# Altium schematic sheet Power.SchDoc
size A
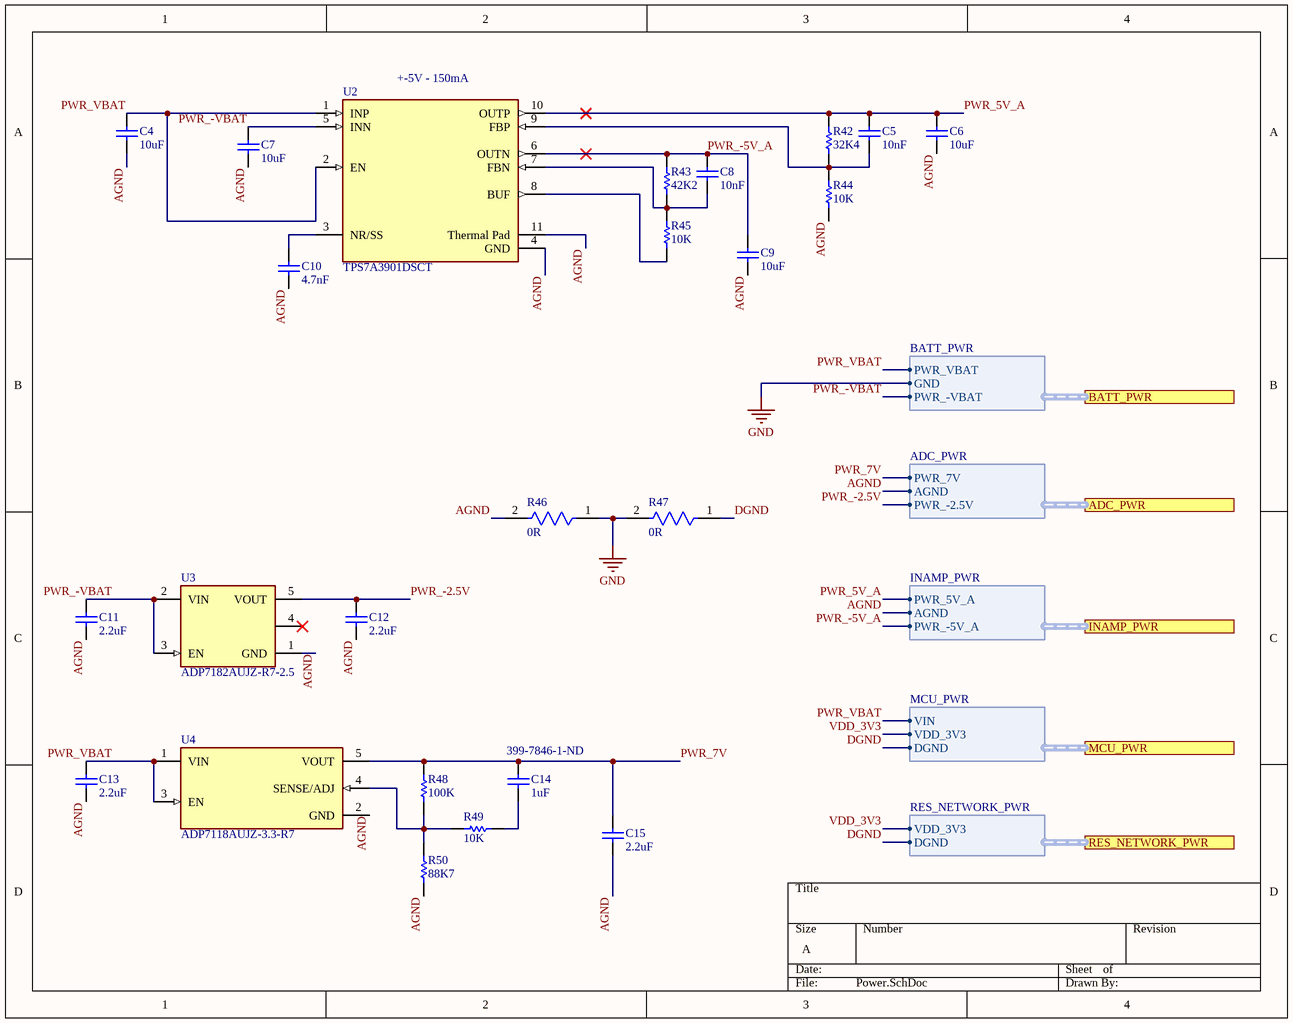
[diagram p0: Power.SchDoc]

## Parts
C4  10uF  [CAPC2013X135X45ML10T25]
C5  10nF  [CAPC1608X90X35LL15T15]
C6  10uF  [CAPC2013X135X45ML10T25]
C7  10uF  [CAPC2013X135X45ML10T25]
C8  10nF  [CAPC1608X90X35LL15T15]
C9  10uF  [CAPC2013X135X45ML10T25]
C10  4.7nF  [CAPC1608X90X35LL15T15]
C11  2.2uF  [CAPC1608X90X35ML10T15]
C12  2.2uF  [CAPC1608X90X35ML10T15]
C13  2.2uF  [CAPC1608X90X35ML10T15]
C14  1uF  Supplier Part Number 1: 399-7846-1-ND  [CAPC1608X95X35LL15T15]
C15  2.2uF  [CAPC1608X90X35ML10T15]
R42  32K4  [RESC1608X55X25ML10T15]
R43  42K2  [RESC0805(2012)_N]
R44  10K  [RESC1609X50X30NL8T20]
R45  10K  [RESC1609X50X30NL8T20]
R46  0R  [FP-CR0603-MFG]
R47  0R  [FP-CR0603-MFG]
R48  100K  [RESC1608X55X25ML10T15]
R49  10K  [RESC1609X50X30NL8T20]
R50  88K7  [RESC1608X55X25ML10T15]
U2  TPS7A3901DSCT  [TPS7A3901DSCT]
U3  ADP7182AUJZ-R7-2.5  [FP-UJ-5-IPC_A]
U4  ADP7118AUJZ-3.3-R7  [FP-UJ-5-IPC_C]

## Ports
ADC_PWR (harness ADC_PWR), BATT_PWR (harness BATT_PWR), INAMP_PWR (harness INAMP_PWR), MCU_PWR (harness MCU_PWR), RES_NETWORK_PWR (harness RES_NETWORK_PWR)

## Harnesses
RES_NETWORK_PWR: VDD_3V3, DGND
MCU_PWR: VDD_3V3, DGND, VIN
INAMP_PWR: AGND, PWR_-5V_A, PWR_5V_A
ADC_PWR: AGND, PWR_-2.5V, PWR_7V
BATT_PWR: GND, PWR_-VBAT, PWR_VBAT

## Nets
GND: R46.1 R47.2 ; port BATT_PWR.GND
AGND: C4.1 C6.1 C7.1 C9.1 C10.1 C11.1 C12.1 C13.1 C15.1 R44.1 R46.2 R50.1 U2.4(GND) U2.11(Thermal_Pad) U3.1(GND) U4.2(GND) ; port INAMP_PWR.AGND, port ADC_PWR.AGND
DGND: R47.1 ; port RES_NETWORK_PWR.DGND, port MCU_PWR.DGND
PWR_5V_A: C5.2 C6.2 R42.1 U2.10(OUTP) ; port INAMP_PWR.PWR_5V_A
PWR_7V: C14.2 C15.2 R48.2 U4.5(VOUT) ; port ADC_PWR.PWR_7V
PWR_-2.5V: C12.2 U3.5(VOUT) ; port ADC_PWR.PWR_-2.5V
PWR_-5V_A: C8.2 C9.2 R43.2 U2.6(OUTN) ; port INAMP_PWR.PWR_-5V_A
PWR_-VBAT: C7.2 C11.2 U2.5(INN) U3.2(VIN) U3.3(EN) ; port BATT_PWR.PWR_-VBAT
PWR_VBAT: C4.2 C13.2 U2.1(INP) U2.2(EN) U4.1(VIN) U4.3(EN) ; port MCU_PWR.VIN, port BATT_PWR.PWR_VBAT
VDD_3V3: port RES_NETWORK_PWR.VDD_3V3, port MCU_PWR.VDD_3V3
NetC5_1: C5.1 R42.2 R44.2 U2.9(FBP)
NetC8_1: C8.1 R43.1 R45.2 U2.7(FBN)
NetC10_2: C10.2 U2.3(NR/SS)
NetC14_1: C14.1 R49.2
NetR45_1: R45.1 U2.8(BUF)
NetR48_1: R48.1 R49.1 R50.2 U4.4(SENSE/ADJ)

Not connected (* = marked no-connect by the designer): U3 4(ADJ)*

## Notes on the sheet
- (near U2) +-5V - 150mA

## Library data of the parts
C4 C6 C7 C9 = CMP-2007-03541-1: Part Number: GRM21BR61E106KA73L; Manufacturer: Murata
C5 C8 = CMP-2006-04374-1: Manufacturer: AVX Interconnect / Elco; Part Number: 06035C-103KAT2A
C10 = CMP-2006-04439-1: Part Number: 06035C472KAT2A; Manufacturer: AVX Interconnect / Elco
C11-C13 C15 = CMP-2006-02820-1: Part Number: GRM188R61E225KA12D; Manufacturer: Murata
C14 = CMP-2006-02216-1: Manufacturer: Kemet; Part Number: C0603C105K3PACTU; Description: KEMET - C0603C105K3PACTU - SMD Multilayer Ceramic Capacitor, 1 µF, 25 V, 0603 [1608 Metric], ± 10%, X5R, C Series KEMET; Dielectric Material: Ceramic; Tolerance: 10%; Dielectric: X5R; Voltage Rating (DC): 25V; Supplier 1: Digi-Key; Manufacturer Part Number: C0603C105K3PACTU; RoHS: Yes; Category: Ceramic Capacitors; Stock 1: 157618; Pricing 1: 1=0.18000, 10=0.12700, 50=0.07220, 100=0.05980, 500=0.04194, 1000=0.03472 (USD); Mount: Surface Mount; Case/Package: 0603; Contact Plating: Tin,Matte; Min Operating Temperature: -55°C; Max Operating Temperature: 85°C; Capacitance: 1uF; Packaging: Tape and Reel; Voltage: 25V; Termination: SMD/SMT; Length: 1.6mm; Height: 0.8mm; Depth: 0.8mm; Radiation Hardening: No; Lead Free: Lead Free; ComponentLink1URL: https://datasheet.ciiva.com/28610/1918694-28610792.pdf?src-supplier=Element14; ComponentLink1Description: https://datasheet.ciiva.com/28610/1918694-28610792.pdf?src-supplier=Element14; ComponentLink2URL: https://datasheet.ciiva.com/5998/40889-5998745.pdf?src-supplier=Farnell; ComponentLink2Description: https://datasheet.ciiva.com/5998/40889-5998745.pdf?src-supplier=Farnell; Supplier Unit Price 1: 0.18
R42 = CMP-2000-04011-1: Manufacturer: Yageo; Part Number: RC0603FR-0732K4L
R43 = CMP-1013-00693-1: 42K2 0.125W 1% 0805 (2012 Metric)  SMD; Case-EIA: 0805; Value: 42200.00 Ohm; Case-Metric: 2012; Power: 0.125 W; Tolerance: 1 %; Technology: SMT
R44 R45 R49 = CMP-1666-00005-4: Chip Resistor, 10 KOhm, +/- 1%, 100 mW, -55 to 155 degC, 0603 (1608 Metric), RoHS, Tape and Reel; Manufacturer: Vishay Semiconductor; Voltage Rating: 75 V; Max Operating Temperature: 155 degC; PackageDescription: 2-Pin Surface Mount Device, Body 1.575 x 0.85 mm; ComponentLink1Description: Manufacturer URL; RoHSCompliant: true; PackageReference: 0603; REACH SVHC: Unknown; Length: 1.55 mm; DatasheetVersion: 06/2012; Packaging: Tape and Reel; Min Operating Temperature: -55 degC; Mounting Technology: Surface Mount; ComponentLink2URL: https://datasheet.ciiva.com/11809/0900766b80d98afc-11809037.pdf; Height: 0.45 mm; ComponentLink2Description: Datasheet; Package Quantity: 5000; ComponentLink1URL: http://www.vishay.com/
R46 R47 = CMP-07231-000023-1: Thick Film Chip Resistors 0603 0Ω 0.1W 5%; Power Rating: 100mW; Resistance: 0mR; Voltage Rating (DC): 50V; Tolerance: 1%; Temperature Coefficient: 500ppm/°C; Depth: 0.8mm; Height: 0.45mm; Case Code (Metric): 1608; Number of Pins: 2; Max Operating Temperature: 155°C; Mount: Surface Mount; REACH SVHC: No SVHC; Radiation Hardening: No; Width: 0.8mm; Max Power Dissipation: 100mW; Thickness: 457um; Package Quantity: 5000; Composition: Thick Film; Case/Package: 0603; Military Standard: Not; Packaging: Tape and Reel; Voltage Rating: 50V; Case Code (Imperial): 0603; Min Operating Temperature: -55°C; Contact Plating: Tin; Length: 1.6mm; Termination: SMD/SMT
R48 = CMP-2100-03662-1: Chip Resistor, 100 KOhm, +/- 1%, 0.1 W, -55 to 155 degC, 0603 (1608 Metric), RoHS, Tape and Reel; Manufacturer: Yageo; Power Rating: 100mW; Voltage Rating: 50V; Temperature Coefficient: 100ppm/degreesC; Datasheet Version: Rev. 5, 10/2016; Height: 0.45mm; Lead Free: LeadFree; Manufacturer URL: http://www.yageo.com/; Package Reference: 0603; Depth: 0.8mm; RoHSCompliant: true; Composition: ThickFilm; Military Standard: Not; Resistance: 100KOhm; Case/Package: 0603; Packaging: TapeandReel; Case Code (Imperial): 0603; Voltage Rating (DC): 50V; Case Code (Metric): 1608; Tolerance: 1%; Termination: SMD/SMT; Min Operating Temperature: -55degC; Number of Pins: 2; Length: 1.6mm; Width: 0.8mm; Datasheet URL: http://www.yageo.com/NewPortal/yageodocoutput?fileName=/pdf/R-Chip/PYu-RC_Group_51_RoHS_L_5.pdf; Package Description: 2-Pin Surface Mount Device, Body 1.6 x 0.8 mm; Max Operating Temperature: 155degC; REACH SVHC: NoSVHC
R50 = CMP-2000-04152-1: Manufacturer: Yageo; Part Number: RC0603FR-0788K7L
U2 = TPS7A3901DSCT: Manufacturer 1: Texas Instruments; Supplier 1: Digi-Key; Supplier Part Number 1: 296-47504-1-ND; Manufacturer Part Number 1: TPS7A3901DSCT
U3 = CMP-09138-000013-1: IC REG LIN NEG ADJ 200MA 5TSOT; Manufacturer: Analog Devices; Number Of Outputs: 1; Min Supply Voltage: -2.7V; Max Junction Temp: +125°C; Dropout Voltage: -185mV; Output Current: -200mA; Max Supply Voltage: -28V; Output Voltage: -1.22/-27.815V; Nominal Supply Current: -33/-650uA; Output Type: AdjustableProgrammable; Accuracy Percentage: 1%; RoHS: TRUE; Ambient Temperature Range Low: -40°C; Digikey Description: IC REG LIN NEG ADJ 200MA 5TSOT; Device Class L3: Voltage Regulators - Linear; Ambient Temperature Range High: +85°C; Manufacturer Part Number: ADP7182AUJZ-R7; ComponentLink2URL: https://www.analog.com/media/en/technical-documentation/data-sheets/ADP7182.pdf; Ipc Land Pattern Name: SOT95P280X100-5; Temperature Range Low: -40°C; ComponentLink2Description: Datasheet; Mouser Description: LDO Regulator Neg -1.22V to -27V 0.2A 5-Pin TSOT T/R; Category: IC; Automotive: No; Device Class L1: Integrated Circuits (ICs); Temperature: -40°C to +125°C; Octopart: https://octopart.com/adp7182aujz-r7-analog+devices-21054665; Device Class L2: Power Management ICs; Height: 1mm; Package: UJ-5; Temperature Range High: +125°C; Lead Free: Yes
U4 = CMP-09138-000020-1: IC REG LIN 3.3V 200MA TSOT23-5; Dropout Voltage: 200mV; Number of Regulators: 1; Max Input Voltage: 20V; Output Type: Fixed; Min Input Voltage: 2.7V; Quiescent Current: 140uA; Polarity: Positive; Min Current Limit: 250mA; Accuracy: 0.8%; Max Operating Temperature: 125°C; Min Operating Temperature: -40°C; Number of Outputs: 1; Contact Plating: Tin; Output Current: 200mA; Lead Free: Contains Lead; Output Voltage: 3.3V; Number of Pins: 5; Mount: Surface Mount; Case/Package: SOT-23-5; Max Output Current: 200mA; Packaging: Tape and Reel